# Altium project PinBoardDesign.PrjPcb
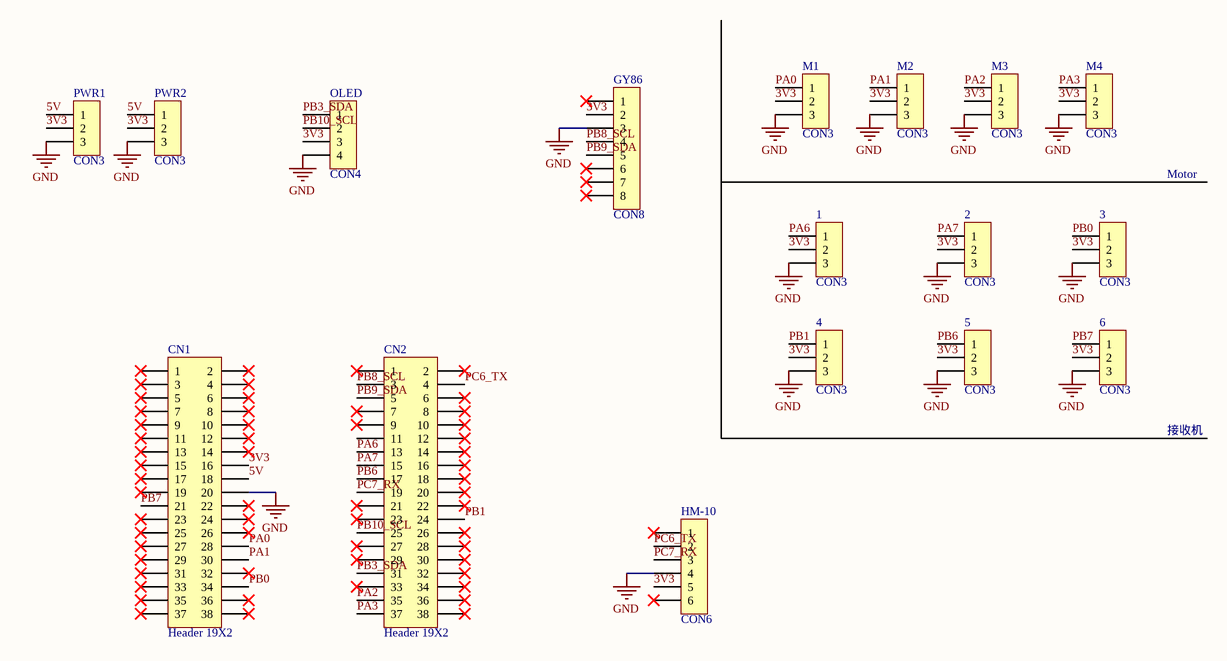
[diagram p0: Sheet1.SchDoc]
1 sheet, 17 parts. Net scope: global (net labels, ports and power ports of the same name join across sheets).
Board files: PCB1.PcbDoc, PCB2.PcbDoc, PCB3.PcbDoc

## Sheet Sheet1.SchDoc
size A4

### Parts
1  CON3  [HDR2.54-M-LI-3P]
2  CON3  [HDR2.54-M-LI-3P]
3  CON3  [HDR2.54-M-LI-3P]
4  CON3  [HDR2.54-M-LI-3P]
5  CON3  [HDR2.54-M-LI-3P]
6  CON3  [HDR2.54-M-LI-3P]
CN1  Header 19X2  [HDR2.54-LI-2x19P]
CN2  Header 19X2  [HDR2.54-LI-2x19P]
GY86  CON8  [HDR2.54-M-LI-8P]
HM-10  CON6  [HDR2.54-M-LI-6P]
M1  CON3  [HDR2.54-M-LI-3P]
M2  CON3  [HDR2.54-M-LI-3P]
M3  CON3  [HDR2.54-M-LI-3P]
M4  CON3  [HDR2.54-M-LI-3P]
OLED  CON4  [HDR2.54-M-LI-4P]
PWR1  CON3  [HDR2.54-M-LI-3P]
PWR2  CON3  [HDR2.54-M-LI-3P]

### Nets
GND: 1.3 2.3 3.3 4.3 5.3 6.3 CN1.20 GY86.3 HM-10.4 M1.3 M2.3 M3.3 M4.3 OLED.4 PWR1.3 PWR2.3
3V3: 1.2 2.2 3.2 4.2 5.2 6.2 CN1.16 GY86.2 HM-10.5 M1.2 M2.2 M3.2 M4.2 OLED.3 PWR1.2 PWR2.2
5V: CN1.18 PWR1.1 PWR2.1
PA0: CN1.28 M1.1
PA1: CN1.30 M2.1
PA2: CN2.35 M3.1
PA3: CN2.37 M4.1
PA6: 1.1 CN2.13
PA7: 2.1 CN2.15
PB0: 3.1 CN1.34
PB1: 4.1 CN2.24
PB3_SDA: CN2.31 OLED.1
PB6: 5.1 CN2.17
PB7: 6.1 CN1.21
PB8_SCL: CN2.3 GY86.4
PB9_SDA: CN2.5 GY86.5
PB10_SCL: CN2.25 OLED.2
PC6_TX: CN2.4 HM-10.2
PC7_RX: CN2.19 HM-10.3

Not connected (* = marked no-connect by the designer): CN1 1* 2* 3* 4* 5* 6* 7* 8* 9* 10* 11* 12* 13* 14* 15* 17* 19* 22* 23* 24* 25* 26* 27* 29* 31* 32* 33* 35* 36* 37* 38*; CN2 1* 2* 6* 7* 8* 9* 10* 11 12* 14* 16* 18* 20* 21* 22* 23* 26* 27* 28* 29* 30* 32* 33* 34* 36* 38*; GY86 1* 6* 7* 8*; HM-10 1* 6*

### Notes on the sheet
- Motor
- 接收机

### Library data of the parts
CN1 CN2 = Header 19X2: Header, 19-Pin, Dual row; Revision: 17-Jul-2002: Re-released for DXP Platform.; Publisher: Altium Limited